# EAGLE schematic 009pcb5 (EAGLE 9.6.2)
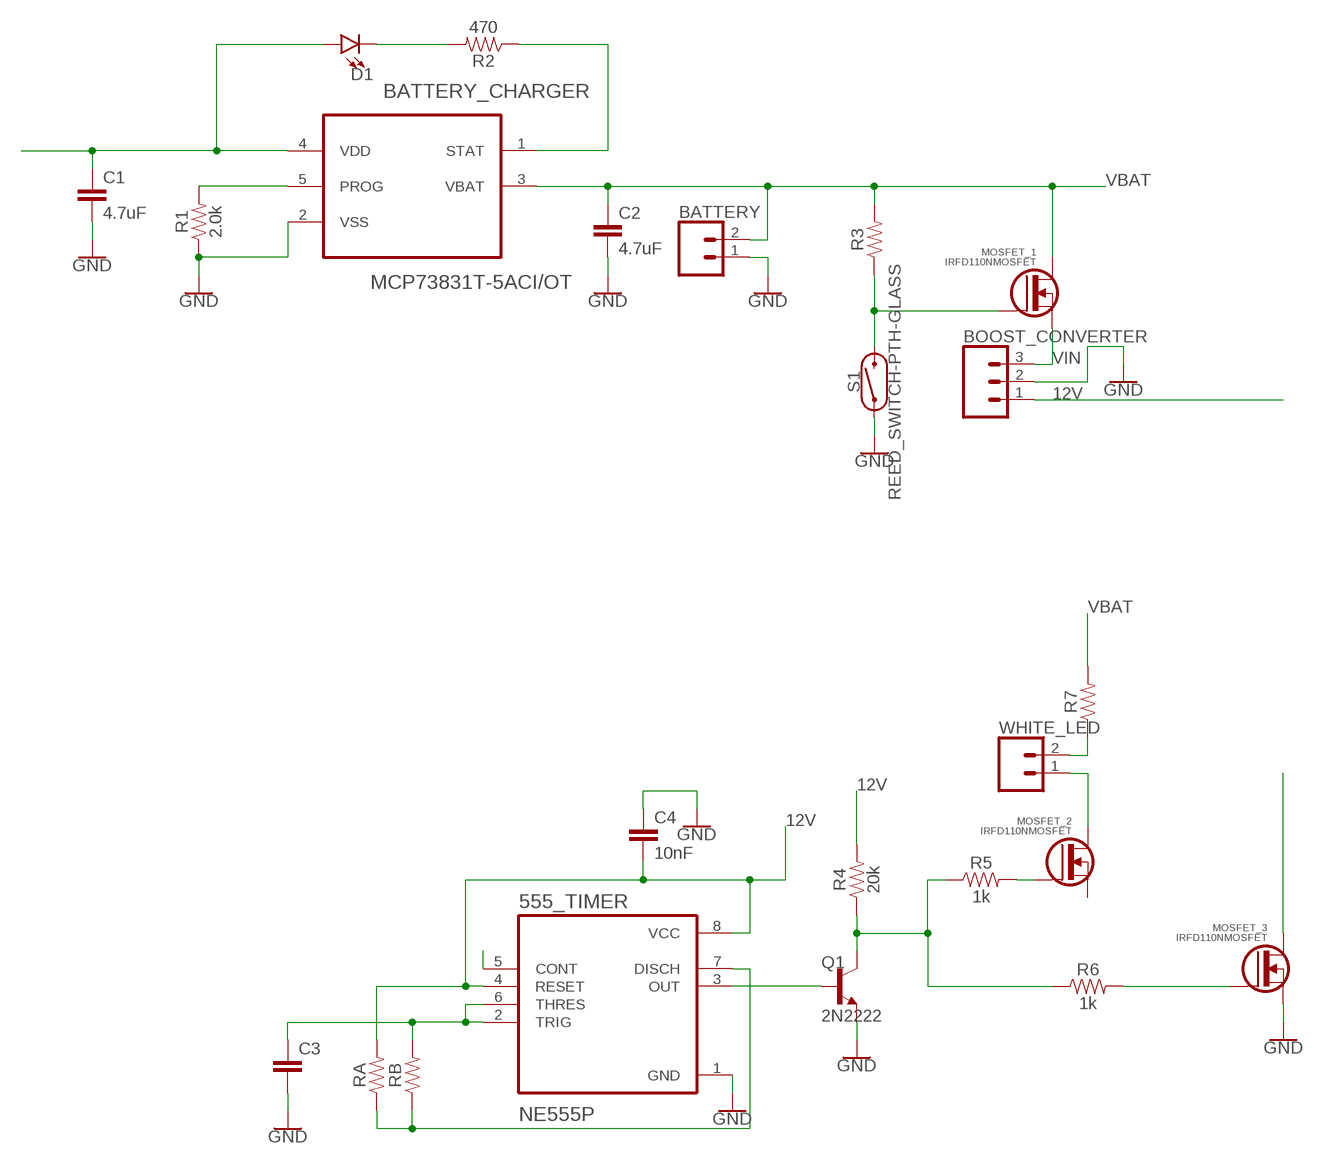
[diagram p0: schematic, sheet 1]

## Parts
555_TIMER  NE555P  [DIP794W45P254L959H508Q8]
BATTERY  CONN_02  [1X02]
BATTERY_CHARGER  MCP73831T-5ACI/OT  [SOT95P280X145-5N]
BOOST_CONVERTER  CONN_03  [1X03]
C1  4.7uF  4.7UF-1206-16V-(+80/-20%)  [1206]
C2  4.7uF  4.7UF-1206-16V-(+80/-20%)  [1206]
C3  4.7UF-1206-16V-(+80/-20%)  [1206]
C4  10nF  10NF-0603-50V-10%  [0603]
D1  LED5MM  [LED_5MM]
MOSFET_1  IRFD110NMOSFET  [DIP4]
MOSFET_2  IRFD110NMOSFET  [DIP4]
MOSFET_3  IRFD110NMOSFET  [DIP4]
Q1  2N2222  [TO127P580H530-3]
R1  2.0k  2.0KOHM-0603-1/10W-5%  [0603]
R2  470  470OHM-0603-1/10W-1%  [0603]
R3  1OHM-0603-1/10W-1%  [0603]
R4  20k  20KOHM-0603-1/10W-1%  [0603]
R5  1k  1KOHM-0603-1/10W-1%  [0603]
R6  1k  1KOHM-0603-1/10W-1%  [0603]
R7  1OHM-0603-1/10W-1%  [0603]
RA  1OHM-0603-1/10W-1%  [0603]
RB  1OHM-0603-1/10W-1%  [0603]
S1  REED_SWITCH-PTH-GLASS  [REED_SWITCH_GLASS]
WHITE_LED  CONN_02  [1X02]

## Nets
12V: 555_TIMER.4(RESET) 555_TIMER.8(VCC) BOOST_CONVERTER.1 C4.2 R4.2 RA.2
GND: 555_TIMER.1(GND) BATTERY.1 BATTERY_CHARGER.2(VSS) BOOST_CONVERTER.2 C1.2 C2.2 C3.2 C4.1 MOSFET_3.S Q1.1(E) R1.1 S1.P$1
N$1: BATTERY_CHARGER.4(VDD) C1.1 D1.A
N$2: BATTERY_CHARGER.1(STAT) R2.1
N$3: D1.K(C) R2.2
N$4: BATTERY_CHARGER.5(PROG) R1.2
N$5: MOSFET_2.G R5.2
N$6: MOSFET_1.G R3.1 S1.P$2
N$7: 555_TIMER.2(TRIG) 555_TIMER.6(THRES) C3.1 RB.2
N$8: 555_TIMER.7(DISCH) RA.1 RB.1
N$9: MOSFET_2.D WHITE_LED.1
N$10: 555_TIMER.3(OUT) Q1.2(B)
N$11: 555_TIMER.5(CONT)
N$12: Q1.3(C) R4.1 R5.1 R6.1
N$13: MOSFET_3.G R6.2
N$14: R7.1 WHITE_LED.2
N$16: MOSFET_3.D
VBAT: BATTERY.2 BATTERY_CHARGER.3(VBAT) C2.1 MOSFET_1.D R3.2 R7.2
VIN: BOOST_CONVERTER.3 MOSFET_1.S
Unconnected: MOSFET_1.D1 MOSFET_2.D1 MOSFET_2.S MOSFET_3.D1

## Library data of the parts
555_TIMER = NE555P:NE555P; DESCRIPTION: Single Precision Timer; DIGI-KEY_PART_NUMBER: 296-NE555P-ND; MF: Texas; MP: NE555P; PACKAGE: PDIP-8 Texas; PURCHASE-URL: https://pricing.snapeda.com/search/part/NE555P/?ref=eda
BATTERY WHITE_LED = SparkFun-Connectors:CONN_02: Multi connection point. Often used as Generic Header-pin footprint for 0.1 inch spaced/style header connections On any of the 0.1 inch spaced packages, you can populate with these: Break Away Headers - Straight <https://www.sparkfun.com/products/116> (PRT-00116) Break Away Male Headers - Right Angle <https://www.sparkfun.com/products/553> (PRT-00553) Female Headers <https://www.sparkfun.com/products/115> (PRT-00115) Break Away Headers - Machine Pin <https://www.sparkfun.com/products/117> (PRT-00117) Break Away Female Headers - Swiss Machine Pin <https://www.sparkfun.com/products/743> (PRT-00743) For SCREWTERMINALS and SPRING TERMINALS visit here: Screw Terimnals on SparkFun.com <https://www.sparkfun.com/search/results?term=Screw+Terminals> (5mm/3.5mm/2.54mm spacing) This device is also useful as a general connection point to wire up your design to another part of your project. Our various solder wires solder well into these plated through hole pads. Hook-Up Wire - Assortment (Stranded, 22 AWG) <https://www.sparkfun.com/products/11375> (PRT-11375) Hook-Up Wire - Assortment (Solid Core, 22 AWG) <https://www.sparkfun.com/products/11367> (PRT-11367) View the entire wire category on our website here <https://www.sparkfun.com/categories/141> Special notes: Molex polarized connector foot print use with: PRT-08233 with associated crimp pins and housings. 2.54_SCREWTERM for use with PRT-10571. 3.5mm Screw Terminal footprints for PRT-08084 5mm Screw Terminal footprints for use with PRT-08432
BATTERY_CHARGER = MCP73831T-5ACI_OT:MCP73831T-5ACI/OT: Charge Management Controller; DESCRIPTION: Linear Battery Charger Controller Li-Ion/Li-Pol 505mA 4.5V 5-Pin SOT-23 T/R; DIGI-KEY_PART_NUMBER: MCP73831T-5ACI/OTTR-ND; MF: Microchip Technology; MP: MCP73831T-5ACI/OT; PACKAGE: SOT-23-5 Microchip; PURCHASE-URL: https://pricing.snapeda.com/search/part/MCP73831T-5ACI/OT/?ref=eda
BOOST_CONVERTER = SparkFun-Connectors:CONN_03: Multi connection point. Often used as Generic Header-pin footprint for 0.1 inch spaced/style header connections On any of the 0.1 inch spaced packages, you can populate with these: Break Away Headers - Straight <https://www.sparkfun.com/products/116> (PRT-00116) Break Away Male Headers - Right Angle <https://www.sparkfun.com/products/553> (PRT-00553) Female Headers <https://www.sparkfun.com/products/115> (PRT-00115) Break Away Headers - Machine Pin <https://www.sparkfun.com/products/117> (PRT-00117) Break Away Female Headers - Swiss Machine Pin <https://www.sparkfun.com/products/743> (PRT-00743) Stackable Header - 3 Pin (Female, 0.1") <https://www.sparkfun.com/products/13875> (PRT-13875) For SCREWTERMINALS and SPRING TERMINALS visit here: Screw Terimnals on SparkFun.com <https://www.sparkfun.com/search/results?term=Screw+Terminals> (5mm/3.5mm/2.54mm spacing) This device is also useful as a general connection point to wire up your design to another part of your project. Our various solder wires solder well into these plated through hole pads. Hook-Up Wire - Assortment (Stranded, 22 AWG) <https://www.sparkfun.com/products/11375> (PRT-11375) Hook-Up Wire - Assortment (Solid Core, 22 AWG) <https://www.sparkfun.com/products/11367> (PRT-11367) View the entire wire category on our website here <https://www.sparkfun.com/categories/141> Special notes: Molex polarized connector foot print use with SKU : PRT-08232 with associated crimp pins and housings.
C1 C2 = SparkFun-Capacitors:4.7UF: 4.7µF ceramic capacitors A capacitor is a passive two-terminal electrical component used to store electrical energy temporarily in an electric field.; PROD_ID: CAP-10300
C3 = SparkFun-Capacitors:4.7UF: 4.7µF ceramic capacitors A capacitor is a passive two-terminal electrical component used to store electrical energy temporarily in an electric field.; PROD_ID: CAP-10300; VALUE: 4.7uF
C4 = SparkFun-Capacitors:10NF: 0.01uF/10nF/10,000pF ceramic capacitors A capacitor is a passive two-terminal electrical component used to store electrical energy temporarily in an electric field. CAP-09321; PROD_ID: CAP-00867
D1 = SparkFun-LED:LED: LED (Generic) Standard schematic elements and footprints for 5mm, 3mm, 1206, and 0603 sized LEDs. Generic LEDs with no color specified.
MOSFET_1-MOSFET_3 = IRFD110:IRFD110: Check availability <https://pricing.snapeda.com/parts/IRFD110/Vishay%20Siliconix/view-part?ref=eda>; AVAILABILITY: In Stock; DESCRIPTION: N-Channel 100V 1A (Ta) 1.3W (Ta) Through Hole 4-DIP, Hexdip, HVMDIP; MF: Vishay Siliconix; MP: IRFD110; PACKAGE: DIP-4 International Rectifier; PRICE: None; PURCHASE-URL: https://pricing.snapeda.com/search/part/IRFD110/?ref=eda
Q1 = 2N2222:2N2222: Bipolar (BJT) Transistor NPN 50V 800mA 500mW Through Hole TO-18 (TO-206AA) Check availability <https://pricing.snapeda.com/parts/2N2222/STMicroelectronics/view-part?ref=eda>; AVAILABILITY: In Stock; DESCRIPTION: Bipolar (BJT) Transistor NPN 30 V 600 mA 250MHz 500 mW Through Hole TO-18; MF: STMicroelectronics; MP: 2N2222; PACKAGE: TO-18 Texas Instruments; PRICE: None
R1 = SparkFun-Resistors:2.0KOHM: 2kΩ resistor A resistor is a passive two-terminal electrical component that implements electrical resistance as a circuit element. Resistors act to reduce current flow, and, at the same time, act to lower voltage levels within circuits. - Wikipedia; PROD_ID: RES-08296
R2 = SparkFun-Resistors:470OHM: 470Ω resistor A resistor is a passive two-terminal electrical component that implements electrical resistance as a circuit element. Resistors act to reduce current flow, and, at the same time, act to lower voltage levels within circuits. - Wikipedia; PROD_ID: RES-07869
R3 R7 RA RB = SparkFun-Resistors:1OHM: 1Ω resistor A resistor is a passive two-terminal electrical component that implements electrical resistance as a circuit element. Resistors act to reduce current flow, and, at the same time, act to lower voltage levels within circuits. - Wikipedia; PROD_ID: RES-08269; VALUE: 1
R4 = SparkFun-Resistors:20KOHM: 20kΩ resistor A resistor is a passive two-terminal electrical component that implements electrical resistance as a circuit element. Resistors act to reduce current flow, and, at the same time, act to lower voltage levels within circuits. - Wikipedia; PROD_ID: RES-09383
R5 R6 = SparkFun-Resistors:1KOHM: 1kΩ resistor A resistor is a passive two-terminal electrical component that implements electrical resistance as a circuit element. Resistors act to reduce current flow, and, at the same time, act to lower voltage levels within circuits. - Wikipedia; PROD_ID: RES-07856
S1 = SparkFun-Switches:REED_SWITCH: Reed Switch A reed switch is a magnetically-actuated switch. When the device is exposed to a magnetic field, the two ferrous materials inside the switch pull together and the switch closes. Variant Overview PTH-GLASS Reed Switch <https://www.sparkfun.com/products/8642> (COM-08642) - PTH reed switch w/ glass body (6.0 x 0.9 mm) PTH-INSULATED Reed Switch - Insulated <https://www.sparkfun.com/products/10601> (COM-10601) - PTH reed switch w/ insulated body (15.1 x 4.2 mm); PROD_ID: SWCH-09282; SF_SKU: COM-08642